# EAGLE design DotCrypt (EAGLE 7.7.0)
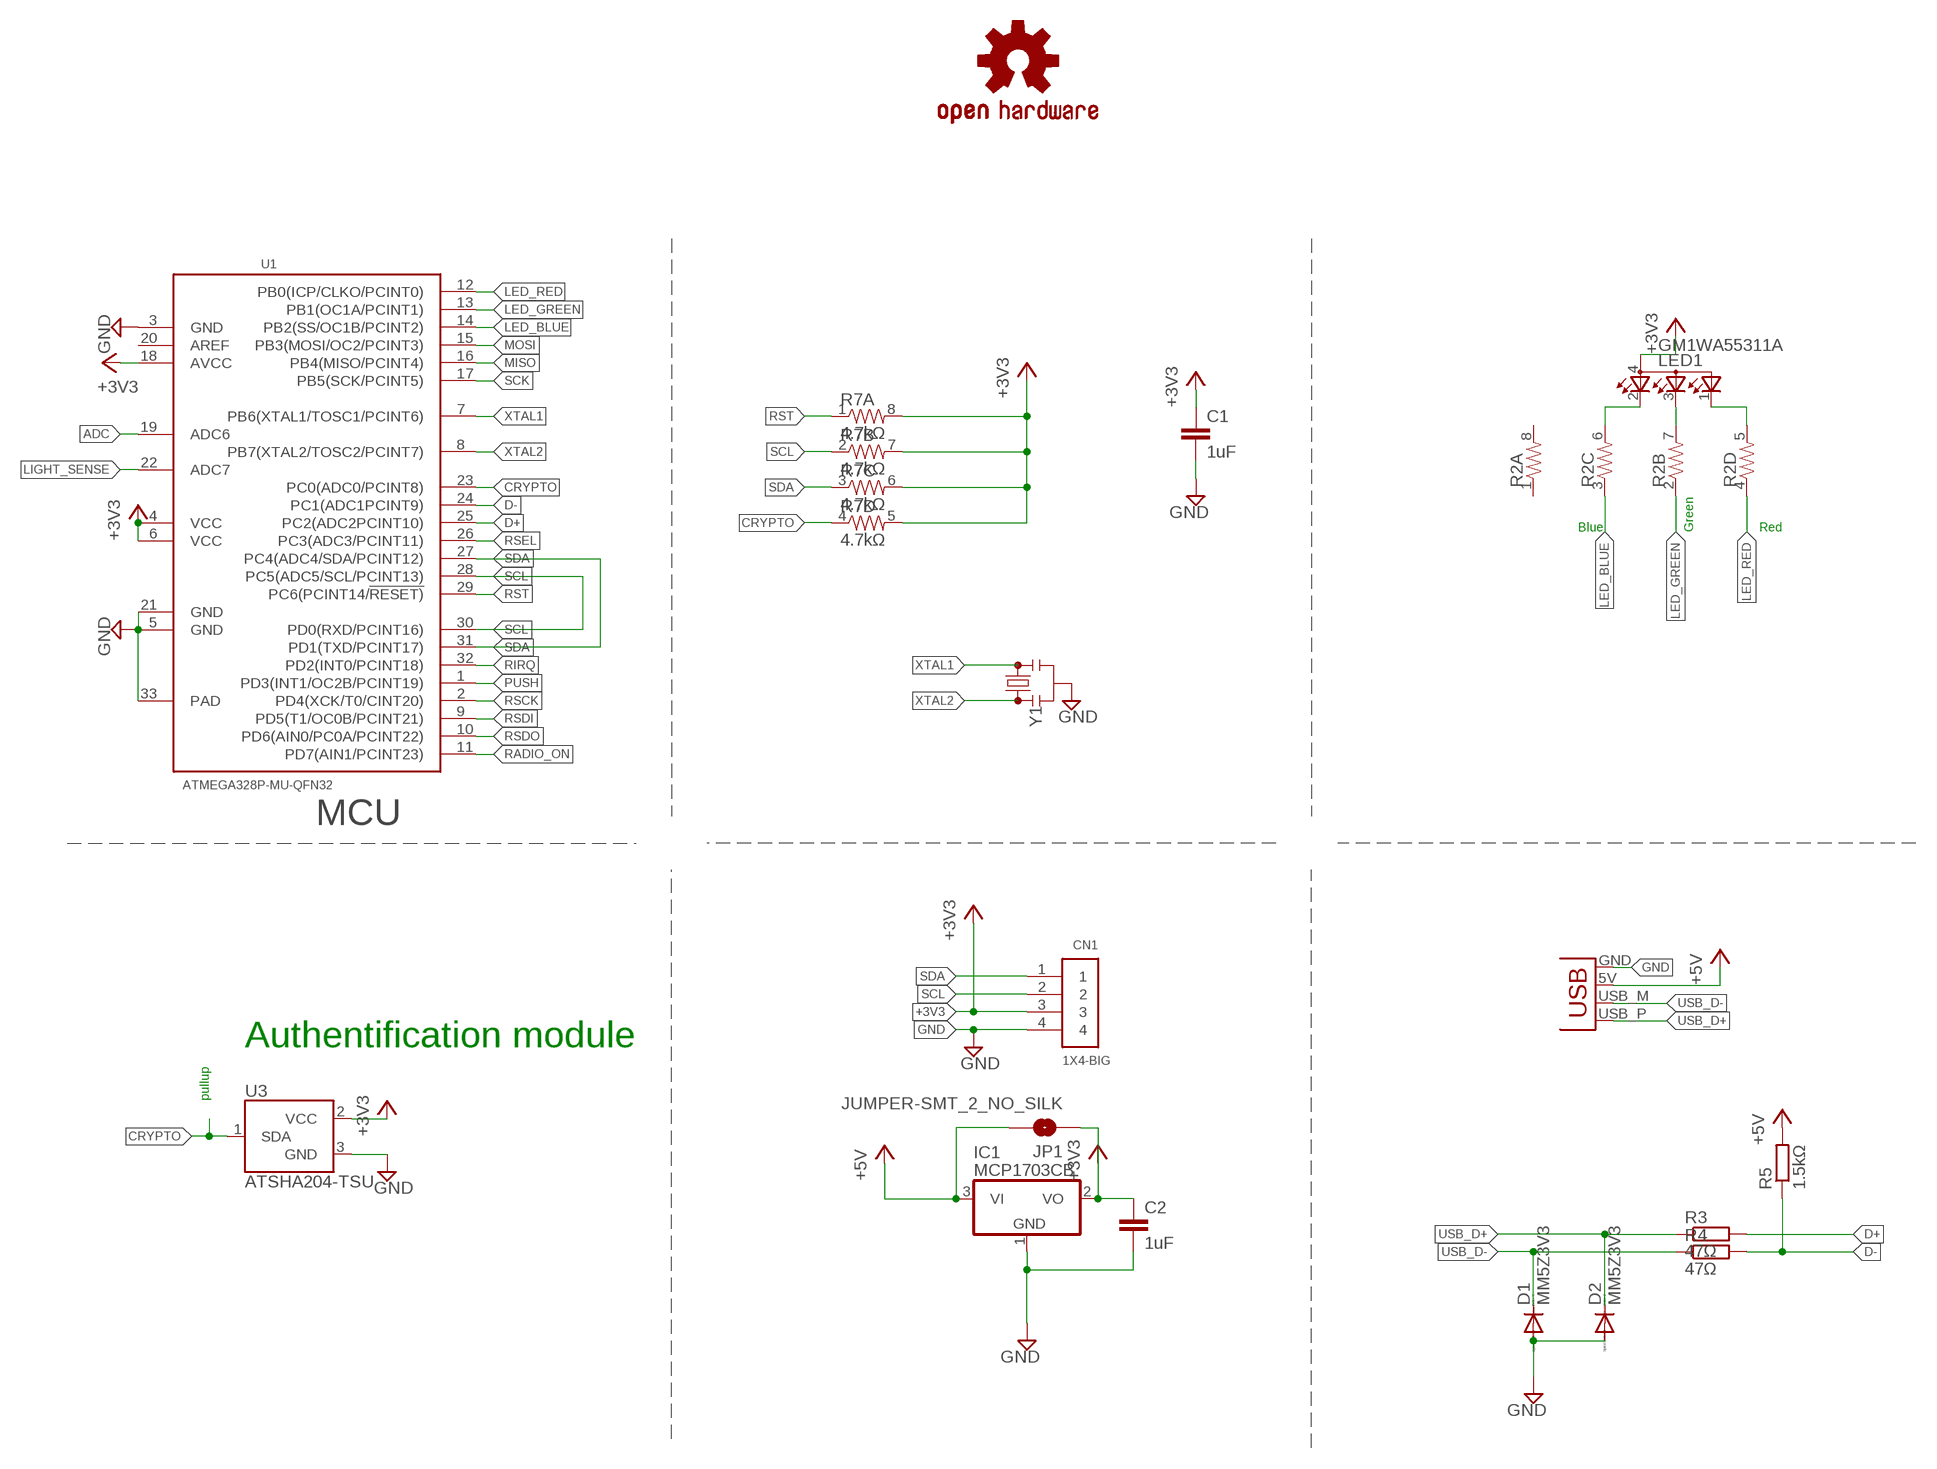
[diagram p0: schematic, sheet 1]

## Parts
C1  1uF  C-EUC0603  [C0603]
C2  1uF  C-EUC0603  [C0603]
CN1  1X4-BIG  [1X04-BIG]
D1  MM5Z3V3  DIODE-SOD523  [SOD523]
D2  MM5Z3V3  DIODE-SOD523  [SOD523]
IC1  MCP1703CB  [SOT23]
JP1  JUMPER-SMT_2_NO_SILK  [SMT-JUMPER_2_NO_SILK]
JP3  USBPCB  [USB-A-PCB]
LED1  GM1WA55311A  [GM1WA55311A]
LOGO1  OSHW-LOGOS  [OSHW-LOGO-S]
R2  RESISTOR-ARRAY0603-ARV  [0603-ARV]
R3  47Ω  R-EU_R0603  [R0603]
R4  47Ω  R-EU_R0603  [R0603]
R5  1.5kΩ  R-EU_R0603  [R0603]
R7  4.7kΩ  RESISTOR-ARRAY0603-ARV  [0603-ARV]
U1  ATMEGA328P-MU-QFN32  MCU-ATMEGA328P-MU(QFN32)  [QFN32G-0.5-5X5MM]
U3  ATSHA204-TSU  [SOT23-3]
Y1  RESONATORSMD-3.2X1.3  [RESONATOR-SMD-3.2X1.3]

## Nets
+3V3: C1.1 C2.1 CN1.3 IC1.2(VO) JP1.1 LED1.4(A) R7.5 R7.6 R7.7 R7.8 U1.4(VCC) U1.6(VCC) U1.18(AVCC) U3.2(VCC)
+5V: IC1.3(VI) JP1.2 JP3.5V(VBUS) R5.2
ADC: U1.19(ADC6)
BLUE: LED1.2(CRED) R2.6
CRYPTO: R7.4 U1.23(PC0(ADC0/PCINT8)) U3.1(SDA)
D+: R3.2 U1.25(PC2(ADC2PCINT10))
D-: R4.2 R5.1 U1.24(PC1(ADC1PCINT9))
GND: C1.2 C2.2 CN1.4 D1.A D2.A IC1.1(GND) JP3.GND U1.3(GND) U1.5(GND) U1.21(GND) U1.33(PAD) U3.3(GND) Y1.2
GREEN: LED1.3(CBLUE) R2.7
LED_BLUE: R2.3 U1.14(PB2(SS/OC1B/PCINT2))
LED_GREEN: R2.2 U1.13(PB1(OC1A/PCINT1))
LED_RED: R2.4 U1.12(PB0(ICP/CLKO/PCINT0))
LIGHT_SENSE: U1.22(ADC7)
MISO: U1.16(PB4(MISO/PCINT4))
MOSI: U1.15(PB3(MOSI/OC2/PCINT3))
PUSH: U1.1(PD3(INT1/OC2B/PCINT19))
RADIO_ON: U1.11(PD7(AIN1/PCINT23))
RED: LED1.1(CGREEN) R2.5
RIRQ: U1.32(PD2(INT0/PCINT18))
RSCK: U1.2(PD4(XCK/T0/CINT20))
RSDI: U1.9(PD5(T1/OC0B/PCINT21))
RSDO: U1.10(PD6(AIN0/PC0A/PCINT22))
RSEL: U1.26(PC3(ADC3/PCINT11))
RST: R7.1 U1.29(PC6(PCINT14/!RESET))
SCK: U1.17(PB5(SCK/PCINT5))
SCL: CN1.2 R7.2 U1.28(PC5(ADC5/SCL/PCINT13)) U1.30(PD0(RXD/PCINT16))
SDA: CN1.1 R7.3 U1.27(PC4(ADC4/SDA/PCINT12)) U1.31(PD1(TXD/PCINT17))
USB_D+: D2.C JP3.USB_P(D+) R3.1
USB_D-: D1.C JP3.USB_M(D-) R4.1
XTAL1: U1.7(PB6(XTAL1/TOSC1/PCINT6)) Y1.3
XTAL2: U1.8(PB7(XTAL2/TOSC2/PCINT7)) Y1.1
Unconnected: R2.1 R2.8 U1.20(AREF)

## Notes on the sheet
- Blue | Green | Red
- MCU
- Authentification module
- pullup

## Library data of the parts
C1 C2 = rcl:C-EU: CAPACITOR, European symbol
CN1 = adafruit:1X4: 4-pin connector
D1 D2 = diode:DIODE-: DIODE
IC1 = linear:MCP1703: 250 mA, 16V, Low Quiescent Current LDO Regulator Source: http://ww1.microchip.com/downloads/en/DeviceDoc/22049b.pdf
JP1 = SparkFun-Jumpers:JUMPER-SMT_2_NO: Normally open jumper This jumper has two pads in close proximity to each other. Apply solder to close the connection. Round pads are easier to solder for beginners, but are a lot larger. SparkFun Product that uses the round pads: SparkFun EL Sequencer <https://www.sparkfun.com/products/12781>
JP3 = Spark:USB
LED1 = led:GM1WA55311A: Chip LED RGB Source: http://document.sharpsma.com/files/GM1WA55311A_SS.pdf
LOGO1 = SparkFun-Aesthetics:OSHW-LOGO: Open-Source Hardware (OSHW) Logo This logo indicates the piece of hardware it is found on incorporates a OSHW license and/or adheres to the definition of open source hardware found here: http://freedomdefined.org/OSHW
R2 R7 = SparkFun:RESISTOR-ARRAY: Array Chip Resistor Source: RS Component / Phycomp
R3-R5 = rcl:R-EU_: RESISTOR, European symbol
U1 = Seeed-OPL-ic:MCU-ATMEGA328P-MU(QFN32): 310010005; MPN: ATMEGA328P-MU
U3 = SparkFun-IC-Special-Function:ATSHA204: Atmel ATSHA204 The Atmel ATSHA204 is an optimized authentication chip that includes a 4.5Kb EEPROM. This array can be used for storage of keys, miscellaneous read/write, read-only, password or secret data, and consumption tracking. Access to the various sections of memory can be restricted in a variety of ways and then the configuration locked to prevent changes. Datasheet <http://www.atmel.com/Images/Atmel-8740-CryptoAuth-ATSHA204-Datasheet.pdf> SparkFun Products SparkFun Electric Imp Shield <https://www.sparkfun.com/products/12887> SparkFun Electric Imp Breakout <https://www.sparkfun.com/products/12886>; PROD_ID: IC-11208
Y1 = SparkFun-Clocks:RESONATOR: Resonators (Generic) Ceramic resonators are clock-generating components, often used to control timing in microcontrollers. They usually have 3 pins: two pins for oscillation, and one pin for ground. Compared to crystals, resonators have worse tolerance, but are usually much cheaper. Plus, they have built-in load capacitors! These devices are used on boards like the Arduino Pro 8MHz <https://www.sparkfun.com/products/11114> and Arduino Pro 16MHz <https://www.sparkfun.com/products/11113>.

## Board
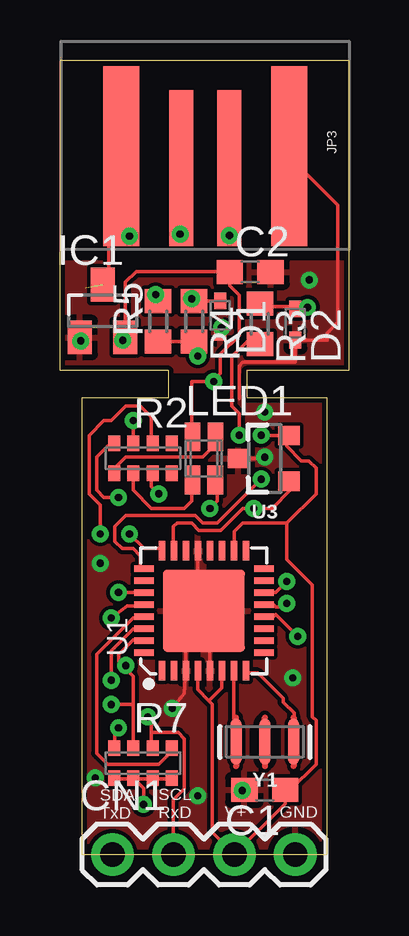
[diagram p1: board, top side]
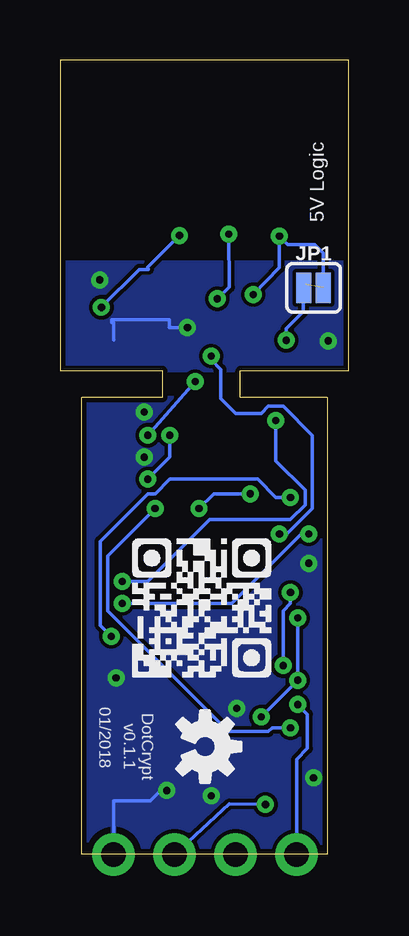
[diagram p2: board, bottom side, seen from below]

Size 12.04 x 33.12 mm. Coordinates in mm from the lower left corner, seen from the top.
Outline: 11.13,19.04 11.13,0 0.91,0 0.91,19.04
Outline: 0.91,19.05 4.52,19.05 4.52,20.17 0,20.17 0,33.12 12.04,33.12 12.04,20.17 7.77,20.17 7.77,19.05 11.13,19.05
Copper layers (1*16): Top 0.035mm / dielectric 1.5mm / Bottom 0.035mm
Design rules "default": minimum track width 6mil, minimum drill 0.3mm, track to track 6mil, track to pad 6mil, pad to pad 6mil, via to via 6mil, smd to smd 6mil, copper to edge 8mil, drill to drill 8mil, minimum pad ring 10mil, minimum via ring 8mil, stop-mask expansion 4mil, vias tented up to drill 0mil, thermal gap 10mil
vRestrict: area 0.9,7 to 6.7,12.9

### Footprints (pad centres in the part's own frame; a part is rotated, then mirrored left to right if it is on the bottom)
C0603 = smd 1.1 x 1: 1 -0.85,0; 2 0.85,0
1X04-BIG = drill 1.016 pad 1.778: 1 0,0; 2 2.54,0; 3 5.08,0; 4 7.62,0
SOD523 = smd 0.7 x 0.5: A 0.7,0; C -0.6,0
SOT23 = smd 1 x 1.4: 1 -0.95,-1.1; 2 0.95,-1.1; 3 0,1.1
SMT-JUMPER_2_NO_SILK = smd 0.635 x 1.27: 1 -0.406,0; 2 0.406,0
USB-A-PCB = smd 7.5 x 1.5: 5V -0.2,-3.5; GND -0.2,3.5 | smd 6.5 x 1: USB_M 0.3,-1; USB_P 0.3,1
GM1WA55311A = smd 0.65 x 1.2: 1 0.477,0.9; 2 -0.475,-0.9; 3 0.475,-0.9; 4 -0.477,0.9
0603-ARV = smd 0.5 x 0.65: 1 -1.2,-0.625; 2 -0.4,-0.625; 3 0.4,-0.625; 4 1.2,-0.625; 5 1.2,0.625; 6 0.4,0.625; 7 -0.4,0.625; 8 -1.2,0.625
R0603 = smd 1 x 1.1: 1 -0.85,0; 2 0.85,0
QFN32G-0.5-5X5MM = smd 0.813 x 0.279: 1 -2.5,1.75; 2 -2.5,1.25; 3 -2.5,0.75; 4 -2.5,0.25; 5 -2.5,-0.25; 6 -2.5,-0.75; 7 -2.5,-1.25; 8 -2.5,-1.75; 17 2.5,-1.75; 18 2.5,-1.25; 19 2.5,-0.75; 20 2.5,-0.25; 21 2.5,0.25; 22 2.5,0.75; 23 2.5,1.25; 24 2.5,1.75 | smd 0.279 x 0.813: 9 -1.75,-2.5; 10 -1.25,-2.5; 11 -0.75,-2.5; 12 -0.25,-2.5; 13 0.25,-2.5; 14 0.75,-2.5; 15 1.25,-2.5; 16 1.75,-2.5; 25 1.75,2.5; 26 1.25,2.5; 27 0.75,2.5; 28 0.25,2.5; 29 -0.25,2.5; 30 -0.75,2.5; 31 -1.25,2.5; 32 -1.75,2.5 | smd 3.429 x 3.429: 33 0,0
SOT23-3 = smd 0.8 x 0.9: 1 -0.95,-1; 2 0.95,-1; 3 0,1.1
RESONATOR-SMD-3.2X1.3 = smd 0.45 x 1.905: 1 -1.2,0; 2 0,0; 3 1.2,0

### Placement (x,y rotation side)
C1  8.53,2.69 180 top
C2  7.92,24.28 0 top
CN1  2.18,0 0 top
D1  6.68,22.48 270 top
D2  9.8,22.15 270 top
IC1  1.78,22.66 0 top
JP1  1.47,23.62 0 bottom
JP3  6.05,28.91 270 top
LED1  5.99,16.51 0 top
LOGO1  5.99,4.5 270 bottom
R2  3.45,16.51 180 top
R3  8.33,22.12 270 top
R4  5.59,22.22 270 top
R5  4.09,22.22 90 top
R7  3.45,3.81 180 top
U1  5.99,10.16 90 top
U3  8.53,16.51 90 top
Y1  8.53,4.7 180 top

### Tracks (layer width: path | path; a pad name or v marks a point on that pad's centre or on a via)
+3V3  (via drill 0.3)
  Top 0.152: 9.45,13.82 7.62,13.82 7.26,13.46 7.26,12.75 U1.18 | 9.45,13.82 10.67,15.04 10.67,16.1 10.36,16.41 10.06,16.41 9.45,17.02 9.45,17.32 U3.2 9.45,17.48 v8.38,17.48 | R7.5 2.29,3.15 3.05,3.15 R7.6 | R7.6 3.2,3.15 3.81,3.15 R7.7 3.96,3.15 4.57,3.15 R7.8 | U1.4 5.74,7.49 5.74,6.88 6.21,6.4 | 4.72,3.15 R7.8 | 7.93,0.41 7.16,0.41 7.16,0.1 CN1.3 | 9.45,13.82 9.45,12.29 10.52,11.23 10.52,5.74 10.67,5.59 10.67,3.76 9.6,2.69 C1.1 9.38,2.12 CN1.3 | LED1.4 5.49,17.48 5.49,19.71 v6.4,19.71 6.68,20.04 6.68,20.85 7.47,21.64 7.47,23.32 7.08,23.71 C2.1 7.08,24.31 3.18,24.31 2.73,23.86 IC1.2 2.8,21.46 v2.62,21.44 | R7.8 4.65,2.93 | 6.21,6.4 6.35,6.25 6.35,0.91 CN1.3 | U1.6 6.74,6.94 6.21,6.4 | v3.48,2.08 3.48,2.76 R7.6
  Bottom 0.152: v6.4,19.71 v8.38,17.48 | v3.48,2.08 4.98,2.11 CN1.3 | JP1.1 1.91,23.62 1.91,22.63 2.62,21.92 v2.62,21.44
+5V  (via drill 0.3)  (1 unrouted)
  Top 0.152: IC1.3 2.03,24.21 2.03,27.66 2.55,27.97 JP3.5V | R5.2 3.99,23.1 v3.99,23.34
  Bottom 0.152: v3.99,23.34 2.9,24.46 v2.9,25.78 2.54,25.43 1.42,25.43 1.07,25.07 JP1.2
BLUE
  Top 0.152: R2.6 3.05,15.8 3.05,15.19 3.81,14.43 5.18,14.43 5.49,14.73 5.49,15.49 LED1.2
CRYPTO  (via drill 0.3)
  Top 0.152: v2.44,5.28 2.29,5.13 2.29,4.52 R7.4 | U3.1 9.6,15.49 9.6,15.19 8.84,14.43 v8.08,14.43 7.62,14.43 6.71,13.51 5.79,13.51 5.49,13.82 4.88,13.82 4.72,13.67 4.72,12.75 U1.23
  Bottom 0.152: v2.44,5.28 3.2,5.28 3.35,5.13 5.03,5.13 10.06,10.16 10.06,12.45 v8.08,14.43
D+  (via drill 0.3)
  Top 0.152: v8.38,15.65 6.55,13.82 5.94,13.82 5.64,14.12 2.74,14.12 2.29,13.67 2.29,13.06 2.59,12.75 3.05,12.75 3.35,12.45 3.35,11.99 U1.25 | v7.47,17.48 7.47,18.39 7.16,18.69 7.16,20.75 7.86,21.45 R3.2
  Bottom 0.152: v7.47,17.48 7.47,16.56 v8.38,15.65
D-  (via drill 0.3)
  Top 0.152: v2.9,13.36 3.51,12.75 4.12,12.75 U1.24 | 3.73,21.31 R5.1 R4.2 5.39,21.17 5.39,21.13 | 5.23,21.29 5.39,21.13 | 5.39,21.13 v5.74,20.78
  Bottom 0.152: v2.9,13.36 2.59,13.36 1.52,14.43 1.52,17.48 2.74,18.69 3.35,18.69 3.66,18.39 4.72,18.39 5.33,19 5.33,20.22 5.74,20.63 v5.74,20.78
GND  (via drill 0.3)
  Top 0.152: D2.A 9.91,21.44 11.13,21.44 11.13,21.74 11.58,22.2 11.58,27.08 9.6,29.06 JP3.GND | 7.47,19 7.47,20.37 7.62,20.52 9.8,20.52 D2.A | 9.75,21.29 D2.A | 6.25,9.7 6.25,10.01 6.1,10.16 U1.33 5.24,9.41 U1.3 | 6.25,9.7 6.25,7.72 U1.5 | U1.21 5.74,10.21 6.25,9.7 | U3.3 8.48,16.51 v8.53,16.56 | v4.67,6.1 5.18,6.71 5.23,7.67 5.23,7.62 | C1.2 7.62,2.69 v7.59,2.67 | D1.A 6.6,21.78 v6.73,21.97
  Bottom 0.152: v8.53,16.56 8.59,16.56 | v7.59,2.67 7.85,2.67 8.28,2.24 9.8,2.24 CN1.4 | v6.73,21.97 7.49,21.97 7.49,22.3 9.88,22.3 9.88,22.17 9.8,22.17 D2.A
  other vias: 8.53,18.44 5.74,2.44 1.47,3.2 1.68,12.14 9.7,7.37 10.39,23.95 0.86,21.41
  pour Bottom: 0.91,19.05 11.2,19.05 11.2,0 0.91,0
  pour Top: 0.91,0 11.07,0 11.07,19.05 0.91,19.05
  pour Top: 0.08,20.14 12.01,20.14 11.94,24.69 0,24.69
  pour Bottom: 0,20.17 12.01,20.17 11.99,24.69 -0.03,24.69
GREEN  (via drill 0.3)
  Top 0.152: v4.12,15.04 3.81,15.34 3.81,15.8 R2.7 | v6.25,14.43 6.55,14.73 6.55,15.49 LED1.3
  Bottom 0.152: v4.12,15.04 5.64,15.04 v6.25,14.43
LED_BLUE  (via drill 0.3)
  Top 0.152: v3.05,18.09 3.05,17.17 R2.3 | v9.45,11.38 8.99,10.92 8.53,10.92 U1.14
  Bottom 0.152: v3.05,18.09 3.05,16.41 1.83,15.19 1.83,14.58 2.44,13.97 5.79,13.97 8.38,11.38 v9.45,11.38
LED_GREEN  (via drill 0.3)
  Top 0.152: v1.68,13.36 1.68,14.58 1.22,15.04 1.22,17.48 1.83,18.09 2.13,18.09 2.74,18.69 3.35,18.69 3.81,18.24 3.81,17.17 R2.2 | v9.45,10.47 9.3,10.47 9.14,10.31 8.99,10.31 8.84,10.47 8.53,10.47 U1.13
  Bottom 0.152: v1.68,13.36 1.98,13.36 4.88,10.47 v9.45,10.47
LED_RED  (via drill 0.3)
  Top 0.152: v2.44,14.88 1.83,14.88 1.52,15.19 1.52,16.56 1.98,17.02 2.13,17.02 R2.4 | v9.91,9.09 8.99,10.01 8.84,9.86 8.53,9.86 U1.12
  Bottom 0.152: v2.44,14.88 3.05,14.88 3.81,15.65 7.47,15.65 8.08,15.04 8.38,15.04 10.36,13.06 10.36,9.55 v9.91,9.09
RED
  Top 0.152: R2.5 2.29,15.95 2.29,16.1 2.74,16.56 5.94,16.56 6.4,17.02 6.4,17.32 LED1.1
RST
  Top 0.152: R7.1 4.57,4.37 4.57,4.22 4.12,3.76 1.98,3.76 1.52,4.22 1.52,8.33 3.05,9.86 3.35,9.86 U1.29
SCL  (via drill 0.3)
  Top 0.152: 3.81,5.13 3.81,5.59 v3.66,5.74 | 3.81,5.13 3.81,4.52 R7.2 | v2.13,7.26 2.13,8.48 3.05,9.4 3.35,9.4 U1.30 | v2.13,9.86 2.79,10.36 3.15,10.36 U1.28 | CN1.2 4.72,2.29 5.18,2.74 5.18,4.83 4.93,5.08 3.86,5.08 3.81,5.13
  Bottom 0.152: v3.66,5.74 v2.13,7.26 v2.13,9.86
SDA  (via drill 0.3)
  Top 0.152: 3.05,6.25 3.05,7.42 2.59,7.87 | 3.05,6.25 3.05,4.52 R7.3 | 2.59,7.87 2.44,8.03 2.44,8.33 3.05,8.94 3.35,8.94 U1.31 | v2.44,10.92 2.44,10.87 2.54,10.92 3.35,10.92 U1.27 | 2.59,7.87 v2.74,7.87 | v2.13,6.25 3.05,6.25
  Bottom 0.152: v2.44,10.92 2.44,10.47 2.74,10.16 v2.74,7.87 | CN1.1 2.18,3.96 1.73,4.42 1.73,5.84 v2.13,6.25
USB_D+  (via drill 0.3)
  Top 0.152: R3.1 8.75,22.83 9.7,22.83 D2.C 9.87,22.81 v10.31,22.81 | v7.06,25.81 7.06,28.59 JP3.USB_P
  Bottom 0.152: v7.06,25.81 8.38,24.49 8.36,24.38 8.74,24.38 v10.31,22.81
USB_D-  (via drill 0.3)
  Top 0.152: D1.C 5.89,23.08 R4.1 5.47,23 v5.49,23.17 | v5,25.86 4.93,28.49 JP3.USB_M
  Bottom 0.152: v5.49,23.17 4.98,23.65 v5,25.86
XTAL1
  Top 0.152: U1.7 7.24,7.57 7.24,5.74 Y1.3
XTAL2
  Top 0.152: U1.8 7.77,7.57 8.23,7.57 9.3,6.5 9.3,6.35 9.75,5.89 9.75,5.74 Y1.1

### Text on the board
tPlace: SDA / TxD | SCL / RxD | V+ | GND
bPlace: 5V Logic | 01/2018 | DotCrypt / v0.1.1